# EAGLE schematic untitled (EAGLE 8.2.0)

## Sheet 1 of 3: Preamplifier
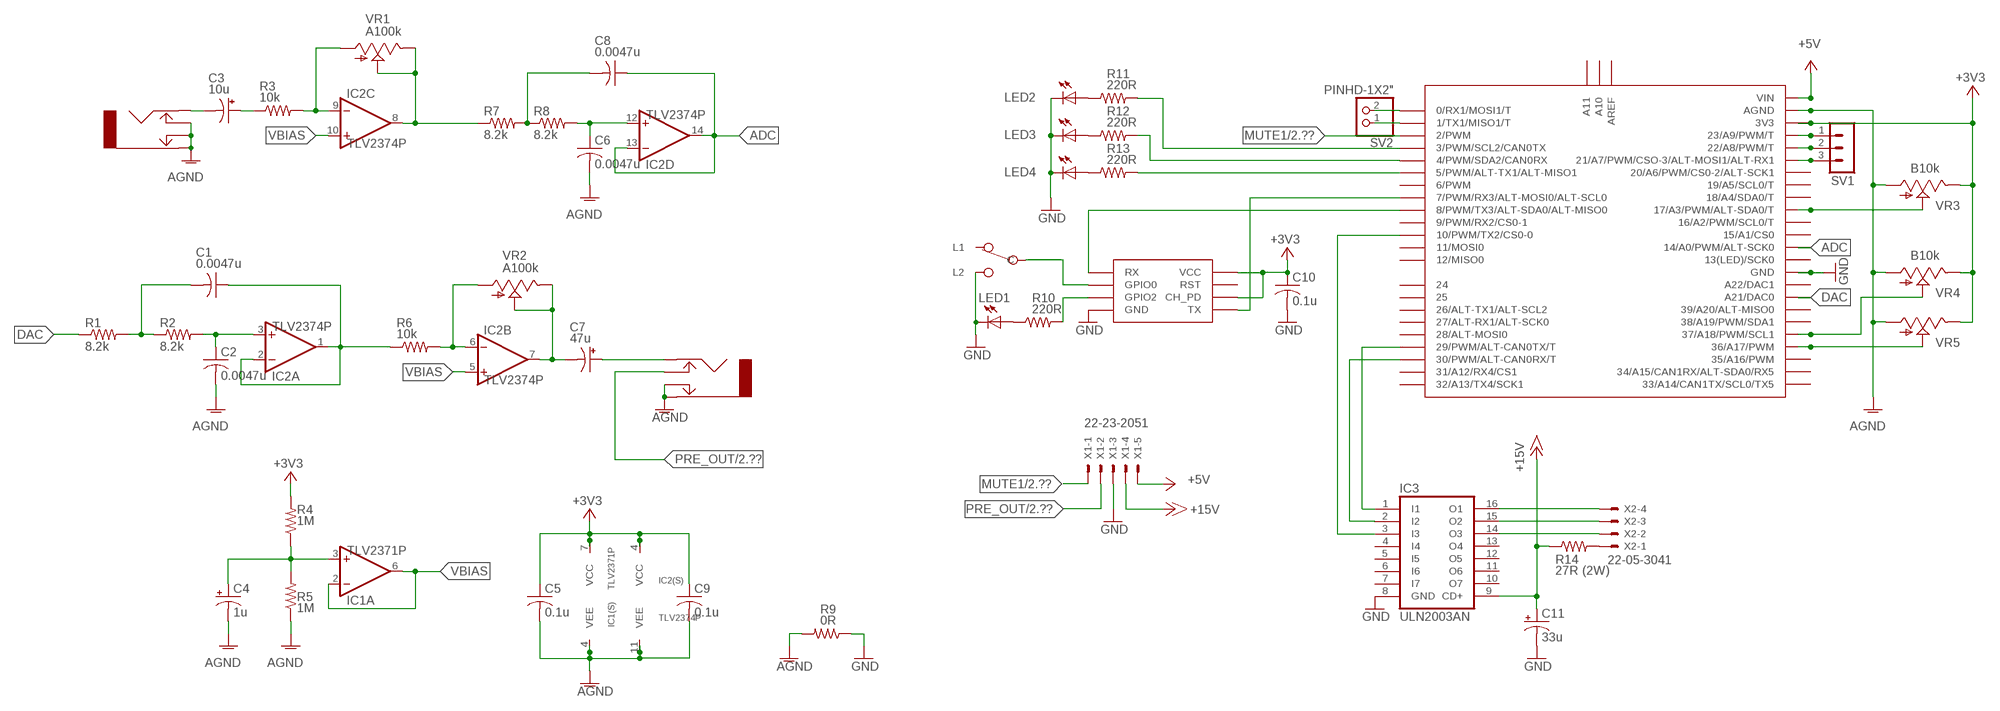
[diagram p0: schematic, sheet 1]

### Parts
C1  0.0047u  C-ECQE(B)103-154  [C-050-035X075]
C2  0.0047u  C-ECQE(B)103-154  [C-050-035X075]
C3  10u  CPOL-USE2.5-6  [E2,5-6]
C4  1u  CPOL-USE2.5-6  [E2,5-6]
C5  0.1u  C-ECQE(B)103-154  [C-050-035X075]
C6  0.0047u  C-ECQE(B)103-154  [C-050-035X075]
C7  47u  CPOL-USE2.5-5  [E2,5-5]
C8  0.0047u  C-ECQE(B)103-154  [C-050-035X075]
C9  0.1u  C-ECQE(B)103-154  [C-050-035X075]
C10  0.1u  C-ECQE(B)103-154  [C-050-035X075]
C11  33u  CPOL-USE2.5-5  [E2,5-5]
IC1  TLV2371P  [DIL08]
IC2  TLV2374P  [DIL14]
IC3  ULN2003AN  [DIL16]
J1  JACK-NYS2162  [JACK-NYS2162]
J2  JACK-NYS2162  [JACK-NYS2162]
LED1  TLLR4400  [LED3MM]
LED2  TLLR4400  [LED3MM]
LED3  TLLR4400  [LED3MM]
LED4  TLLR4400  [LED3MM]
MCU1  ESP8266-01  [ESP8266-01]
MCU2  TEENSY-3.6  [T36--OUTERPINS]
R1  8.2k  R-US_0207/7  [0207/7]
R2  8.2k  R-US_0207/7  [0207/7]
R3  10k  R-US_0207/7  [0207/7]
R4  1M  R-US_0207/7  [0207/7]
R5  1M  R-US_0207/7  [0207/7]
R6  10k  R-US_0207/7  [0207/7]
R7  8.2k  R-US_0207/7  [0207/7]
R8  8.2k  R-US_0207/7  [0207/7]
R9  0R  R-US_0207/7  [0207/7]
R10  220R  R-US_0207/7  [0207/7]
R11  220R  R-US_0207/7  [0207/7]
R12  220R  R-US_0207/7  [0207/7]
R13  220R  R-US_0207/7  [0207/7]
R14  27R (2W)  R-US_0411/12  [0411/12]
S1  SPDT-SLIDE  [SPDT-SLIDE]
SV1  MA03-1  [MA03-1]
SV2  PINHD-1X2"  [1X02]
VR1  A100k  POT-ALPHA-RV09AF-40  [RV09AF]
VR2  A100k  POT-ALPHA-RV09AF-40  [RV09AF]
VR3  B10k  POT-ALPHA-RV09AF-40  [RV09AF]
VR4  B10k  POT-ALPHA-RV09AF-40  [RV09AF]
VR5  B10k  POT-ALPHA-RV09AF-40  [RV09AF]
X1  22-23-2051  [22-23-2051]
X2  22-05-3041  [22-05-3041]

### Nets
+3V3: C5.1 C9.1 C10.1 IC1.7((S):VCC) IC2.4((S):VCC) MCU1.CH_PD MCU1.VCC MCU2.3V3(1)(3V3) MCU2.3V3(2)(3V3) R4.2 VR3.E VR4.E VR5.E
+5V: MCU2.VIN X1.5 ; also sheet 2,3
+15V [PWR]: C11.+ IC3.9(CD+) R14.1 X1.4 ; also sheet 2,3
ADC: C8.1 IC2.13(D:IN-) IC2.14(D:OUT) MCU2.14(14/A0/PWM/ALT-SCK0)
AGND: C2.2 C4.- C5.2 C6.2 C9.2 IC1.4((S):VEE) IC2.11((S):VEE) J1.S J1.SN J1.TN J2.S J2.SN MCU2.AGND R5.1 R9.2 VR3.A VR4.A VR5.A
DAC: MCU2.DAC0(A21/DAC0) R1.1
GND: C10.2 C11.- IC3.8(GND) LED1.K(C) LED2.K(C) LED3.K(C) LED4.K(C) MCU1.GND MCU2.GND(1)(GND) MCU2.GND(2)(GND) R9.1 S1.L2 X1.3 ; also sheet 2
MUTE1: MCU2.2(2/PWM) X1.1 ; also sheet 2,3
N$34: C3.+ R3.1
N$36: IC2.9(C:IN-) R3.2 VR1.A
N$37: C8.2 R7.2 R8.1
N$38: C6.1 IC2.12(D:IN+) R8.2
N$39: C1.1 IC2.1(A:OUT) IC2.2(A:IN-) R6.1
N$40: C1.2 R1.2 R2.1
N$41: C2.1 IC2.3(A:IN+) R2.2
N$42: IC2.6(B:IN-) R6.2 VR2.A
N$43: C7.- IC2.7(B:OUT) VR2.E VR2.S
N$44: IC2.8(C:OUT) R7.1 VR1.E VR1.S
N$45: C4.+ IC1.3(A:IN+) R4.1 R5.2
N$46: MCU1.GPIO2 R10.2
N$47: MCU1.TX MCU2.7(7/PWM/RX3/ALT-MOSI0/ALT-SCL0)
N$48: MCU1.RX MCU2.8(8/PWM/TX3/ALT-SDA0/ALT-MISO0)
N$49: MCU1.GPIO0 S1.C
N$50: LED1.A R10.1
N$52: MCU2.36(36/A17/PWM) VR5.S
N$54: LED4.A R13.1
N$55: LED3.A R12.1
N$56: LED2.A R11.1
N$57: MCU2.5(5/PWM/ALT-TX1/ALT-MISO1) R13.2
N$58: MCU2.4(4/PWM/SDA2/CAN0RX) R12.2
N$59: MCU2.3(3/PWM/SCL2/CAN0TX) R11.2
N$60: C3.- J1.T
N$61: C7.+ J2.T
N$62: MCU2.37(37/A18/PWM/SCL1) VR4.S
N$63: R14.2 X2.1
N$64: IC3.16(O1) X2.4
N$65: IC3.15(O2) X2.3
N$67: IC3.14(O3) X2.2
N$68: IC3.3(I3) MCU2.10(10/PWM/TX2/CS0-0)
N$70: IC3.2(I2) MCU2.30(30/PWM/ALT-CAN0RX/T)
N$71: IC3.1(I1) MCU2.29(29/PWM/ALT-CAN0TX/T)
N$73: MCU2.23(23/A9/PWM/T) SV1.1
N$76: MCU2.22(22/A8/PWM/T) SV1.2
N$77: MCU2.21(21/A7/PWM/CSO-3/ALT-MOSI1/ALT-RX1) SV1.3
N$78: MCU2.17(17/A3/PWM/ALT-SDA0/T) VR3.S
N$81: MCU2.1(1/TX1/MISO1/T) SV2.1
N$82: MCU2.0(0/RX1/MOSI1/T) SV2.2
PRE_OUT: J2.TN X1.2 ; also sheet 2,3
VBIAS: IC1.2(A:IN-) IC1.6(A:OUT) IC2.5(B:IN+) IC2.10(C:IN+)
Unconnected: IC3.4(I4) IC3.5(I5) IC3.6(I6) IC3.7(I7) IC3.10(O7) IC3.11(O6) IC3.12(O5) IC3.13(O4) MCU1.RST MCU2.6(6/PWM) MCU2.9(9/PWM/RX2/CS0-1) MCU2.11(11/MOSI0) MCU2.12(12/MISO0) MCU2.13(13(LED)/SCK0) MCU2.15(15/A1/CS0) MCU2.16(16/A2/PWM/SCL0/T) MCU2.18(18/A4/SDA0/T) MCU2.19(19/A5/SCL0/T) MCU2.20(20/A6/PWM/CS0-2/ALT-SCK1) MCU2.24 MCU2.25 MCU2.26(26/ALT-TX1/ALT-SCL2) MCU2.27(27/ALT-RX1/ALT-SCK0) MCU2.28(28/ALT-MOSI0) MCU2.31(31/A12/RX4/CS1) MCU2.32(32/A13/TX4/SCK1) MCU2.33(33/A14/CAN1TX/SCL0/TX5) MCU2.34(34/A15/CAN1RX/ALT-SDA0/RX5) MCU2.35(35/A16/PWM) MCU2.38(38/A19/PWM/SDA1) MCU2.39(39/A20/ALT-MISO0) MCU2.A10 MCU2.A11 MCU2.AREF MCU2.DAC1(A22/DAC1) S1.L1

## Sheet 2 of 3: Power Amplifier
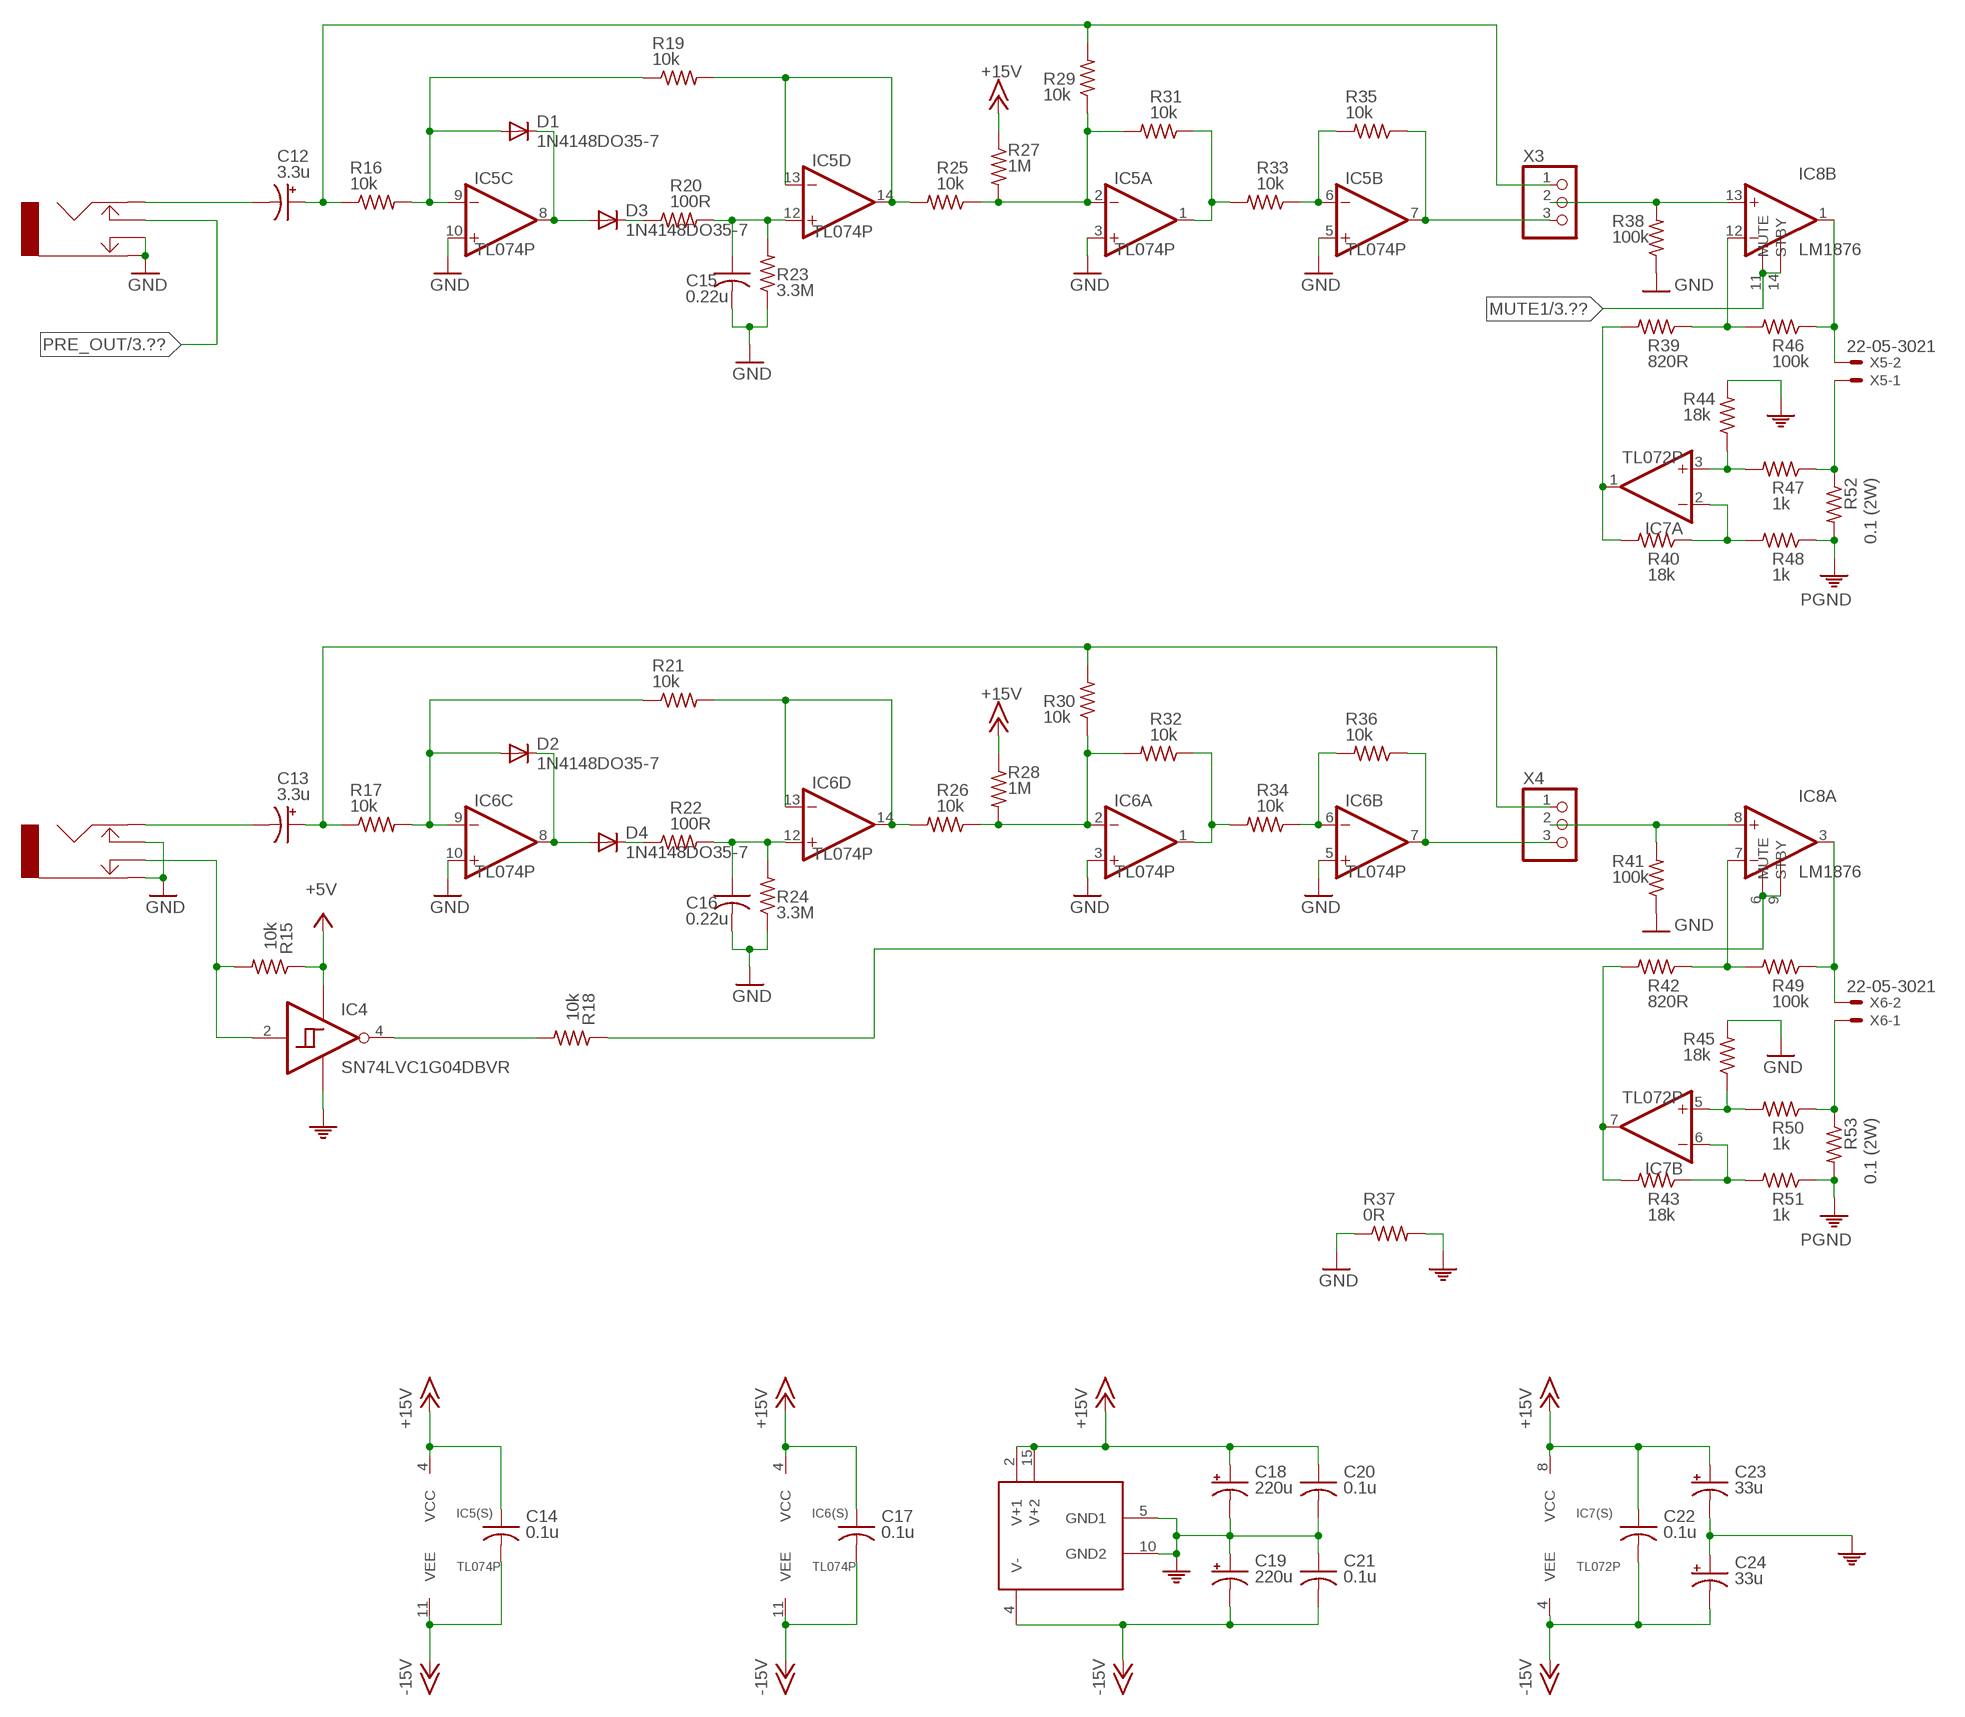
[diagram p1: schematic, sheet 2]

### Parts
C12  3.3u  CPOL-USE2.5-5  [E2,5-5]
C13  3.3u  CPOL-USE2.5-5  [E2,5-5]
C14  0.1u  C-ECQE(B)103-154  [C-050-035X075]
C15  0.22u  C-ECQE(B)184-334  [C-075-052X106]
C16  0.22u  C-ECQE(B)184-334  [C-075-052X106]
C17  0.1u  C-ECQE(B)103-154  [C-050-035X075]
C18  220u  CPOL-USE5-10.5  [E5-10,5]
C19  220u  CPOL-USE5-10.5  [E5-10,5]
C20  0.1u  C-ECQE(B)103-154  [C-050-035X075]
C21  0.1u  C-ECQE(B)103-154  [C-050-035X075]
C22  0.1u  C-ECQE(B)103-154  [C-050-035X075]
C23  33u  CPOL-USE2.5-5  [E2,5-5]
C24  33u  CPOL-USE2.5-5  [E2,5-5]
D1  1N4148DO35-7  [DO35-7]
D2  1N4148DO35-7  [DO35-7]
D3  1N4148DO35-7  [DO35-7]
D4  1N4148DO35-7  [DO35-7]
IC4  SN74LVC1G04DBVR  [SOT23-5]
IC5  TL074P  [DIL14]
IC6  TL074P  [DIL14]
IC7  TL072P  [DIL08]
IC8  LM1876  [MULTIWATT15]
J3  CH1  JACK-NYS2162  [JACK-NYS2162]
J4  CH2  JACK-NYS2162  [JACK-NYS2162]
R15  10k  R-US_0207/7  [0207/7]
R16  10k  R-US_0207/7  [0207/7]
R17  10k  R-US_0207/7  [0207/7]
R18  10k  R-US_0207/7  [0207/7]
R19  10k  R-US_0207/7  [0207/7]
R20  100R  R-US_0207/7  [0207/7]
R21  10k  R-US_0207/7  [0207/7]
R22  100R  R-US_0207/7  [0207/7]
R23  3.3M  R-US_0207/7  [0207/7]
R24  3.3M  R-US_0207/7  [0207/7]
R25  10k  R-US_0207/7  [0207/7]
R26  10k  R-US_0207/7  [0207/7]
R27  1M  R-US_0207/7  [0207/7]
R28  1M  R-US_0207/7  [0207/7]
R29  10k  R-US_0207/7  [0207/7]
R30  10k  R-US_0207/7  [0207/7]
R31  10k  R-US_0207/7  [0207/7]
R32  10k  R-US_0207/7  [0207/7]
R33  10k  R-US_0207/7  [0207/7]
R34  10k  R-US_0207/7  [0207/7]
R35  10k  R-US_0207/7  [0207/7]
R36  10k  R-US_0207/7  [0207/7]
R37  0R  R-US_0207/7  [0207/7]
R38  100k  R-US_0207/7  [0207/7]
R39  820R  R-US_0207/7  [0207/7]
R40  18k  R-US_0207/7  [0207/7]
R41  100k  R-US_0207/7  [0207/7]
R42  820R  R-US_0207/7  [0207/7]
R43  18k  R-US_0207/7  [0207/7]
R44  18k  R-US_0207/7  [0207/7]
R45  18k  R-US_0207/7  [0207/7]
R46  100k  R-US_0207/7  [0207/7]
R47  1k  R-US_0207/7  [0207/7]
R48  1k  R-US_0207/7  [0207/7]
R49  100k  R-US_0207/7  [0207/7]
R50  1k  R-US_0207/7  [0207/7]
R51  1k  R-US_0207/7  [0207/7]
R52  0.1 (2W)  R-US_0411/12  [0411/12]
R53  0.1 (2W)  R-US_0411/12  [0411/12]
X3  PINHD-1X3  [1X03]
X4  PINHD-1X3  [1X03]
X5  22-05-3021  [22-05-3021]
X6  22-05-3021  [22-05-3021]

### Nets
+5V: IC4.5(VCC) R15.1 ; also sheet 1,3
+15V [PWR]: C14.1 C17.1 C18.+ C20.1 C22.1 C23.+ IC5.4((S):VCC) IC6.4((S):VCC) IC7.8((S):VCC) IC8.2(V+1) IC8.15(V+2) R27.1 R28.1 ; also sheet 1,3
-15V [PWR]: C14.2 C17.2 C19.- C21.2 C22.2 C24.- IC5.11((S):VEE) IC6.11((S):VEE) IC7.4((S):VEE) IC8.4(V-) ; also sheet 3
GND: C15.2 C16.2 IC5.3(A:IN+) IC5.5(B:IN+) IC5.10(C:IN+) IC6.3(A:IN+) IC6.5(B:IN+) IC6.10(C:IN+) J3.S J3.SN J4.S J4.TN R23.1 R24.1 R37.1 R38.1 R41.1 R45.2 ; also sheet 1
INPUT1: IC5.7(B:OUT) R35.1 X3.3
INPUT2: IC6.7(B:OUT) R36.1 X4.3
MUTE1: IC8.11(B:MUTE) IC8.14(B:STBY) ; also sheet 1,3
MUTE2: IC8.6(A:MUTE) IC8.9(A:STBY) R18.1
N$1: IC7.1(A:OUT) R39.2 R40.2
N$2: IC8.12(B:-IN) R39.1 R46.2
N$3 [PWR]: IC8.1(B:OUT) R46.1 X5.2
N$4: IC7.3(A:IN+) R44.1 R47.2
N$5: IC7.2(A:IN-) R40.1 R48.2
N$6: IC7.5(B:IN+) R45.1 R50.2
N$7 [PWR]: R47.1 R52.1 X5.1
N$8 [PWR]: R50.1 R53.1 X6.1
N$9: IC8.7(A:-IN) R42.1 R49.2
N$10: IC7.6(B:IN-) R43.1 R51.2
N$11 [PWR]: IC8.3(A:OUT) R49.1 X6.2
N$12: IC7.7(B:OUT) R42.2 R43.2
N$13: D1.A IC5.9(C:IN-) R16.2 R19.1
N$14: D3.C R20.1
N$15: C15.1 IC5.12(D:IN+) R20.2 R23.2
N$16: D2.A IC6.9(C:IN-) R17.2 R21.1
N$17: D1.C D3.A IC5.8(C:OUT)
N$18: C12.+ R16.1 R29.2 X3.1
N$19: IC5.2(A:IN-) R25.1 R27.2 R29.1 R31.2
N$20: IC5.1(A:OUT) R31.1 R33.2
N$21: IC5.6(B:IN-) R33.1 R35.2
N$22: C13.+ R17.1 R30.2 X4.1
N$23: IC5.13(D:IN-) IC5.14(D:OUT) R19.2 R25.2
N$24: IC6.1(A:OUT) R32.1 R34.2
N$25: IC6.6(B:IN-) R34.1 R36.2
N$26: IC6.13(D:IN-) IC6.14(D:OUT) R21.2 R26.2
N$27: D4.C R22.1
N$28: D2.C D4.A IC6.8(C:OUT)
N$29: IC6.2(A:IN-) R26.1 R28.2 R30.1 R32.2
N$30: C16.1 IC6.12(D:IN+) R22.2 R24.2
N$31: C12.- J3.T
N$32: IC8.8(A:+IN) R41.2 X4.2
N$33: C13.- J4.T
N$35: IC8.13(B:+IN) R38.2 X3.2
N$53: IC4.2(A) J4.SN R15.2
N$72: IC4.4(Y) R18.2
PGND [PWR]: C18.- C19.+ C20.2 C21.1 C23.- C24.+ IC4.3(GND) IC8.5(GND1) IC8.10(GND2) R37.2 R44.2 R48.1 R51.1 R52.2 R53.2 ; supply symbol labelled PE ; also sheet 3
PRE_OUT: J3.TN ; also sheet 1,3

## Sheet 3 of 3: Power Supply
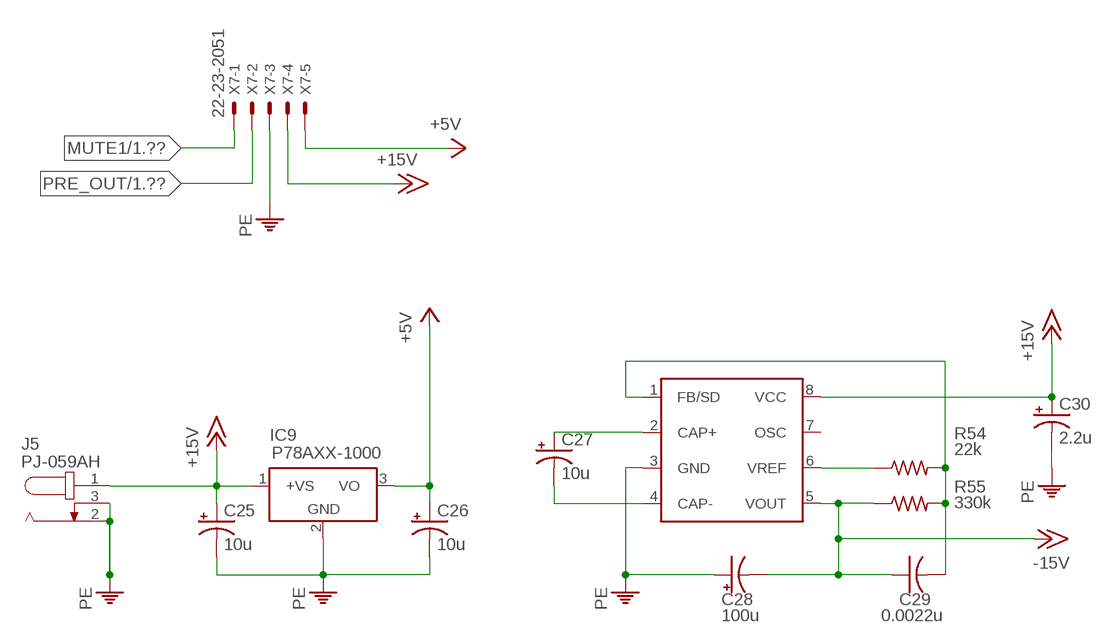
[diagram p2: schematic, sheet 3]

### Parts
C25  10u  CAP-TAN10UF  [CPOL-025-050X050]
C26  10u  CAP-TAN10UF  [CPOL-025-050X050]
C27  10u  CAP-TAN10UF  [CPOL-025-050X050]
C28  100u  CPOL-USE2.5-6  [E2,5-6]
C29  0.0022u  C-US050-035X075  [C050-035X075]
C30  2.2u  CPOL-USE2-5  [E2-5]
IC9  P78AXX-1000  [P78AXX-1000]
IC10  LT1054  [DIL08]
J5  PJ-059AH  JACK-PJ-059AH  [JACK-PJ-059AH]
R54  22k  R-US_0207/7  [0207/7]
R55  330k  R-US_0207/7  [0207/7]
X7  22-23-2051  [22-23-2051]

### Nets
+5V: C26.+ IC9.3(VO) X7.5 ; also sheet 1,2
+15V [PWR]: C25.+ C30.+ IC9.1(+VS) IC10.8(VCC) J5.1 X7.4 ; also sheet 1,2
-15V [PWR]: C28.- C29.1 IC10.5(VOUT) R55.1 ; also sheet 2
MUTE1: X7.1 ; also sheet 1,2
N$66: C27.+ IC10.2(CAP+)
N$69: C27.- IC10.4(CAP-)
N$74: IC10.6(VREF) R54.1
N$75: C29.2 IC10.1(FB/SD) R54.2 R55.2
PGND [PWR]: C25.- C26.- C28.+ C30.- IC9.2(GND) IC10.3(GND) J5.2 J5.3 X7.3 ; supply symbol labelled PE ; also sheet 2
PRE_OUT: X7.2 ; also sheet 1,2
Unconnected: IC10.7(OSC)

## Library data of the parts
C1 C2 C5 C6 C8-C10 C14-C17 C20-C22 = passive:C-ECQE(B)
C3 C4 C7 C11-C13 C18 C19 C23 C24 C28 C30 = rcl:CPOL-US: POLARIZED CAPACITOR, American symbol
C25-C27 = passive:CAP-TAN10UF
C29 = rcl:C-US: CAPACITOR, American symbol
D1-D4 = diode:1N4148: DIODE high speed (Philips)
IC1 = opamps:TLV2371P: TLV237x 500-μA/Ch, 3-MHz Rail-to-Rail Input and Output Operational Amplifiers With Shutdown
IC2 = opamps:TLV2374P: TLV237x 500-μA/Ch, 3-MHz Rail-to-Rail Input and Output Operational Amplifiers With Shutdown
IC3 = uln-udn:ULN2003A: DRIVER ARRAY
IC4 = logic:SN74LVC1G04DBVR
IC5 IC6 = opamps:TL074P: TL07xx Low-Noise JFET-Input Operational Amplifiers
IC7 = opamps:TL072P: TL07xx Low-Noise JFET-Input Operational Amplifiers
IC8 = integrated_amplifiers:LM1876
IC9 = power:P78AXX-1000
IC10 = power:LT1054
J1-J4 = connectors:JACK-NYS2162
J5 = connectors:JACK-PJ-059AH
LED1-LED4 = led:TLLR4400: Low Current (2mA) LED 3 mm Tinted Diffused Package color RED Source: Data sheet <http://www.farnell.com/datasheets/391100.pdf>; MF: VISHAY SEMICONDUCTOR; OC_FARNELL: 1612437
MCU1 = mcus:ESP8266-01
MCU2 = mcus:TEENSY-3.6
R1-R13 = resistor:R-US_: RESISTOR, American symbol
R14-R55 = rcl:R-US_: RESISTOR, American symbol
S1 = switches:SPDT-SLIDE
SV1 = con-lstb:MA03-1: PIN HEADER; OC_FARNELL: unknown; OC_NEWARK: unknown
SV2 = connectors:PINHD-1X2
VR1-VR5 = passive:POT-ALPHA-RV09AF-40
X1 X7 = con-molex:22-23-2051: .100" (2.54mm) Center Header - 5 Pin; MF: MOLEX; MPN: 22-23-2051; OC_FARNELL: 1462952; OC_NEWARK: 38C9178
X2 = connectors:22-05-3041: .100" (2.54mm) Right Angle Header - 4 Pin; MF: MOLEX
X3 X4 = connectors:PINHD-1X3: PIN HEADER
X5 X6 = connectors:22-05-3021: .100" (2.54mm) Right Angle Header - 2 Pin; MF: MOLEX

## Net classes
0 default: width 0.406 mm, drill 0.406 mm, clearance 0.61 mm
1 PWR: width 0.914 mm, drill 0.889 mm, clearance 0.61 mm
2 3.3: width 0.61 mm, drill 0.61 mm, clearance 0.61 mm